# EAGLE design SplitterBoxRevC (EAGLE 7.5.0)
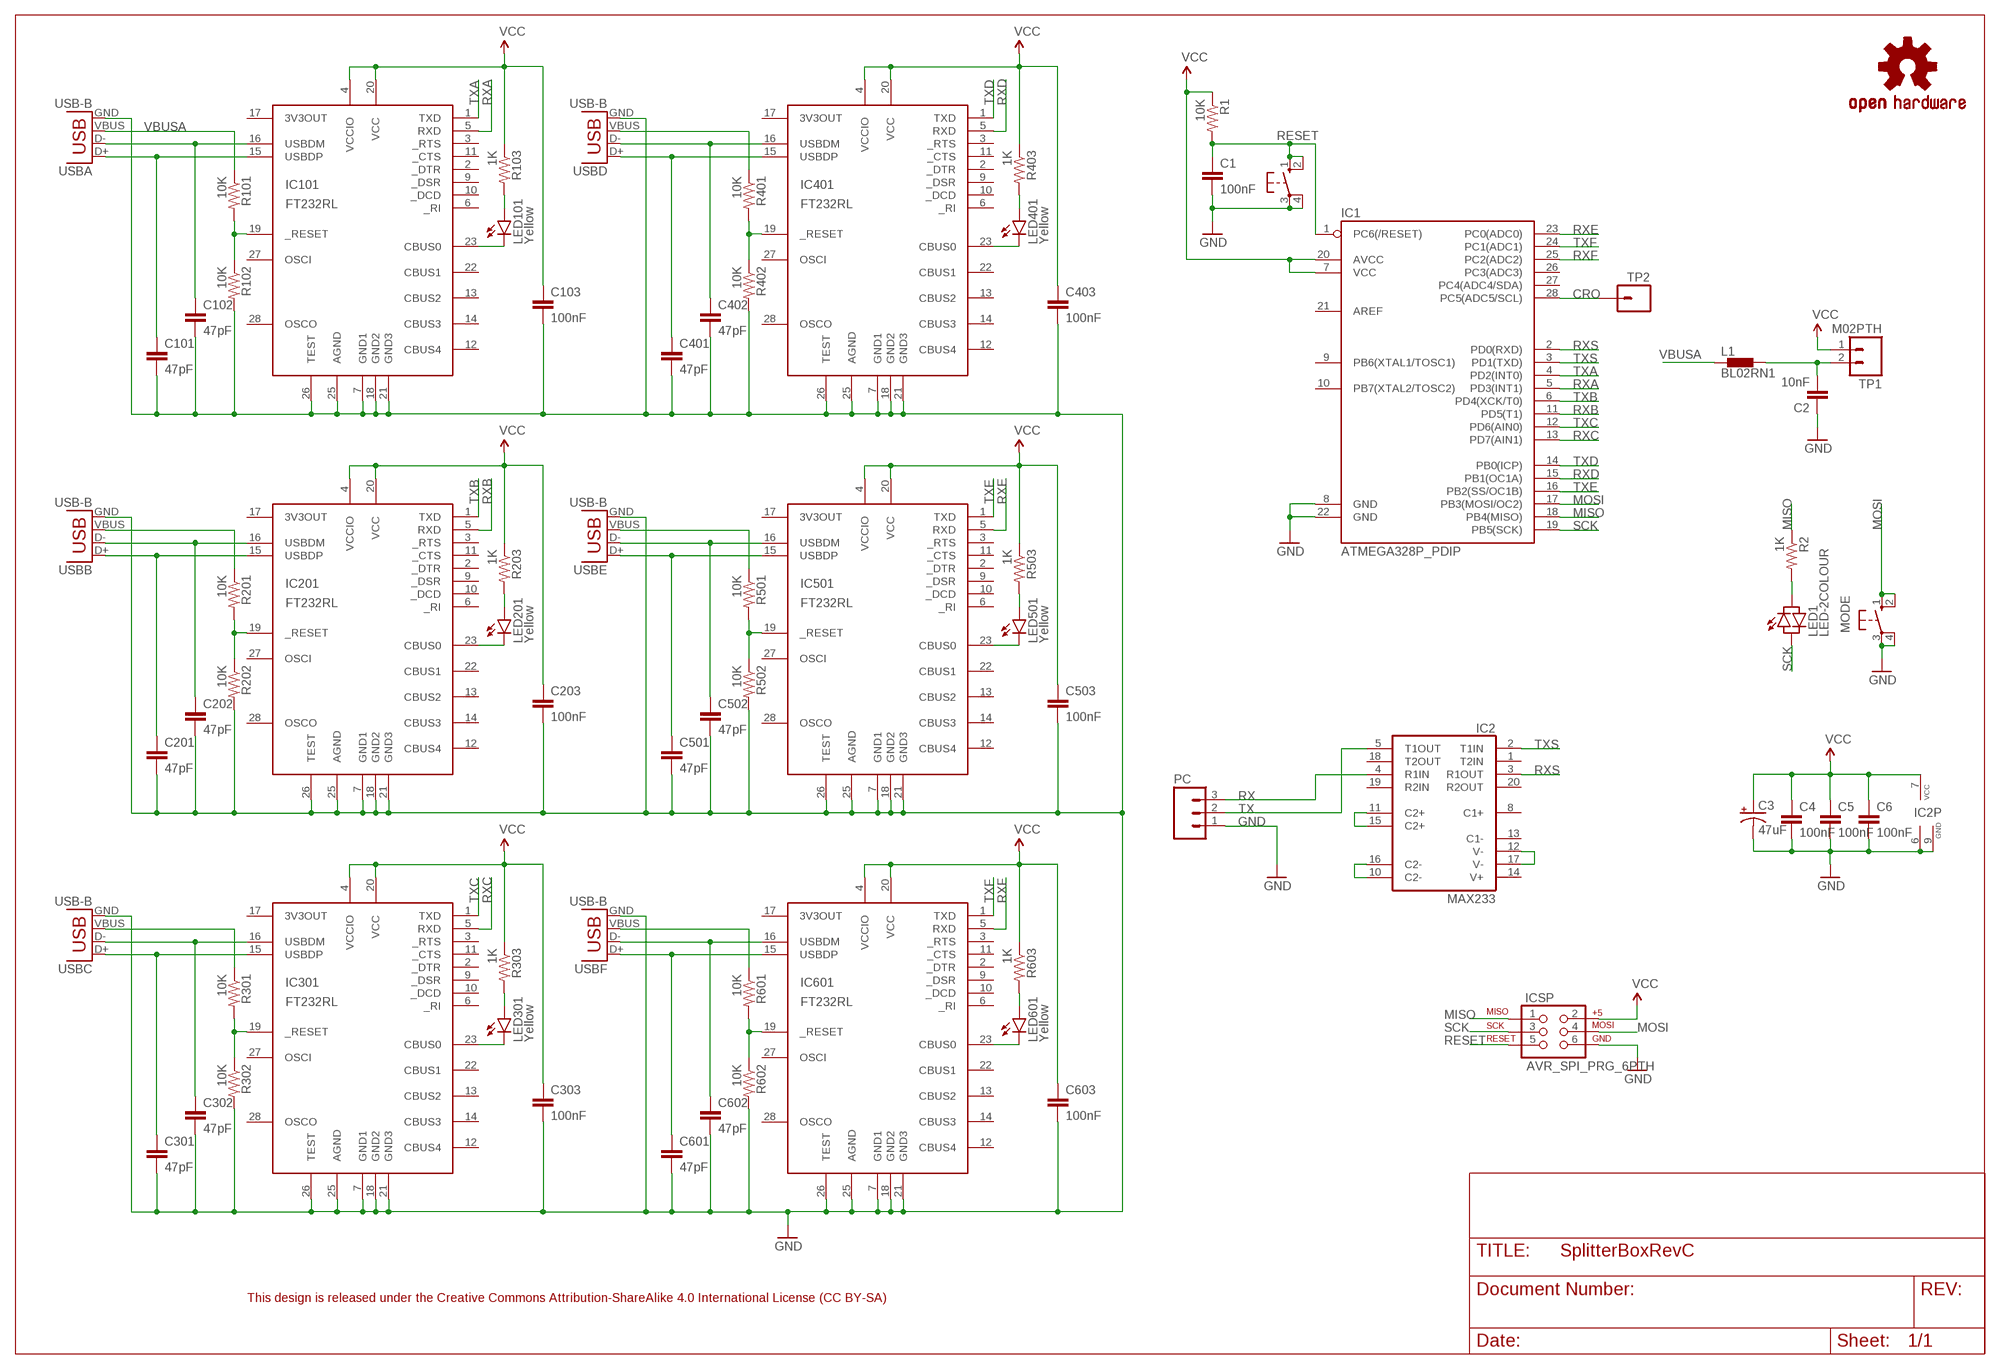
[diagram p0: schematic, sheet 1]

## Parts
C1  100nF  CAPPTH  [CAP-PTH-SMALL]
C2  10nF  CAPPTH  [CAP-PTH-SMALL]
C3  47uF  CAP_POLPTH1  [CPOL-RADIAL-100UF-25V]
C4  100nF  CAPPTH  [CAP-PTH-SMALL]
C5  100nF  CAPPTH  [CAP-PTH-SMALL]
C6  100nF  CAPPTH  [CAP-PTH-SMALL]
C101  47pF  CAPPTH  [CAP-PTH-SMALL]
C102  47pF  CAPPTH  [CAP-PTH-SMALL]
C103  100nF  CAPPTH  [CAP-PTH-SMALL]
C201  47pF  CAPPTH  [CAP-PTH-SMALL]
C202  47pF  CAPPTH  [CAP-PTH-SMALL]
C203  100nF  CAPPTH  [CAP-PTH-SMALL]
C301  47pF  CAPPTH  [CAP-PTH-SMALL]
C302  47pF  CAPPTH  [CAP-PTH-SMALL]
C303  100nF  CAPPTH  [CAP-PTH-SMALL]
C401  47pF  CAPPTH  [CAP-PTH-SMALL]
C402  47pF  CAPPTH  [CAP-PTH-SMALL]
C403  100nF  CAPPTH  [CAP-PTH-SMALL]
C501  47pF  CAPPTH  [CAP-PTH-SMALL]
C502  47pF  CAPPTH  [CAP-PTH-SMALL]
C503  100nF  CAPPTH  [CAP-PTH-SMALL]
C601  47pF  CAPPTH  [CAP-PTH-SMALL]
C602  47pF  CAPPTH  [CAP-PTH-SMALL]
C603  100nF  CAPPTH  [CAP-PTH-SMALL]
IC1  ATMEGA328P_PDIP  [DIL28-3]
IC2  MAX233  [DIL20]
IC101  FT232RL  [SSOP28DB]
IC201  FT232RL  [SSOP28DB]
IC301  FT232RL  [SSOP28DB]
IC401  FT232RL  [SSOP28DB]
IC501  FT232RL  [SSOP28DB]
IC601  FT232RL  [SSOP28DB]
ICSP  AVR_SPI_PRG_6PTH  [2X3]
L1  BL02RN1  [BL02RN1]
LED1  LED-2COLOUR  [LED3MM]
LED101  Yellow  LED-LH3MM  [LED3MM_LARGEHOLES]
LED201  Yellow  LED-LH3MM  [LED3MM_LARGEHOLES]
LED301  Yellow  LED-LH3MM  [LED3MM_LARGEHOLES]
LED401  Yellow  LED-LH3MM  [LED3MM_LARGEHOLES]
LED501  Yellow  LED-LH3MM  [LED3MM_LARGEHOLES]
LED601  Yellow  LED-LH3MM  [LED3MM_LARGEHOLES]
LOGO1  OSHW-LOGOS  [OSHW-LOGO-S]
MODE  10-XX  [B3F-10XX]
PC  M03PTH  [1X03]
R1  10K  RESISTORPTH-1/4W  [AXIAL-0.4]
R2  1K  RESISTORPTH-1/4W  [AXIAL-0.4]
R101  10K  RESISTORPTH-1/4W  [AXIAL-0.4]
R102  10K  RESISTORPTH-1/4W  [AXIAL-0.4]
R103  1K  RESISTORPTH-1/4W  [AXIAL-0.4]
R201  10K  RESISTORPTH-1/4W  [AXIAL-0.4]
R202  10K  RESISTORPTH-1/4W  [AXIAL-0.4]
R203  1K  RESISTORPTH-1/4W  [AXIAL-0.4]
R301  10K  RESISTORPTH-1/4W  [AXIAL-0.4]
R302  10K  RESISTORPTH-1/4W  [AXIAL-0.4]
R303  1K  RESISTORPTH-1/4W  [AXIAL-0.4]
R401  10K  RESISTORPTH-1/4W  [AXIAL-0.4]
R402  10K  RESISTORPTH-1/4W  [AXIAL-0.4]
R403  1K  RESISTORPTH-1/4W  [AXIAL-0.4]
R501  10K  RESISTORPTH-1/4W  [AXIAL-0.4]
R502  10K  RESISTORPTH-1/4W  [AXIAL-0.4]
R503  1K  RESISTORPTH-1/4W  [AXIAL-0.4]
R601  10K  RESISTORPTH-1/4W  [AXIAL-0.4]
R602  10K  RESISTORPTH-1/4W  [AXIAL-0.4]
R603  1K  RESISTORPTH-1/4W  [AXIAL-0.4]
RST  10-XX  [B3F-10XX]
TP1  M02PTH  [1X02]
TP2  M01PTH  [1X01]
USBA  USB-B  USBPTH  [USB-B-PTH]
USBB  USB-B  USBPTH  [USB-B-PTH]
USBC  USB-B  USBPTH  [USB-B-PTH]
USBD  USB-B  USBPTH  [USB-B-PTH]
USBE  USB-B  USBPTH  [USB-B-PTH]
USBF  USB-B  USBPTH  [USB-B-PTH]

## Nets
CRO: IC1.28(PC5(ADC5/SCL)) TP2.1
GND: C1.2 C2.1 C3.2(-) C4.2 C5.2 C6.2 C101.2 C102.2 C103.2 C201.2 C202.2 C203.2 C301.2 C302.2 C303.2 C401.2 C402.2 C403.2 C501.2 C502.2 C503.2 C601.2 C602.2 C603.2 IC1.8(GND) IC1.22(GND) IC2.6(GND) IC2.9(GND) IC101.7(GND1) IC101.18(GND2) IC101.21(GND3) IC101.25(AGND) IC101.26(TEST) IC201.7(GND1) IC201.18(GND2) IC201.21(GND3) IC201.25(AGND) IC201.26(TEST) IC301.7(GND1) IC301.18(GND2) IC301.21(GND3) IC301.25(AGND) IC301.26(TEST) IC401.7(GND1) IC401.18(GND2) IC401.21(GND3) IC401.25(AGND) IC401.26(TEST) IC501.7(GND1) IC501.18(GND2) IC501.21(GND3) IC501.25(AGND) IC501.26(TEST) IC601.7(GND1) IC601.18(GND2) IC601.21(GND3) IC601.25(AGND) IC601.26(TEST) ICSP.6 MODE.3(P) MODE.4(P1) PC.1 R102.P$2 R202.P$2 R302.P$2 R402.P$2 R502.P$2 R602.P$2 RST.3(P) RST.4(P1) USBA.GND USBB.GND USBC.GND USBD.GND USBE.GND USBF.GND
MISO: IC1.18(PB4(MISO)) ICSP.1 R2.P$1
MOSI: IC1.17(PB3(MOSI/OC2)) ICSP.4 MODE.1(S) MODE.2(S1)
N$1: C201.1 IC201.15(USBDP) USBB.D+
N$2: C202.1 IC201.16(USBDM) USBB.D-
N$3: IC201.19(_RESET) R201.P$2 R202.P$1
N$4: LED201.A R203.P$2
N$5: IC201.23(CBUS0) LED201.K(C)
N$6: C401.1 IC401.15(USBDP) USBD.D+
N$7: C402.1 IC401.16(USBDM) USBD.D-
N$9: IC2.10(C2-) IC2.16(C2-)
N$10: C2.2 L1.2 TP1.2
N$13: IC2.11(C2+) IC2.15(C2+)
N$14: IC2.12(V-) IC2.17(V-)
N$18: IC401.19(_RESET) R401.P$2 R402.P$1
N$19: LED401.A R403.P$2
N$20: IC401.23(CBUS0) LED401.K(C)
N$21: C301.1 IC301.15(USBDP) USBC.D+
N$22: C302.1 IC301.16(USBDM) USBC.D-
N$23: R201.P$1 USBB.VBUS
N$24: IC301.19(_RESET) R301.P$2 R302.P$1
N$25: LED301.A R303.P$2
N$27: IC301.23(CBUS0) LED301.K(C)
N$28: R301.P$1 USBC.VBUS
N$29: C101.1 IC101.15(USBDP) USBA.D+
N$30: C102.1 IC101.16(USBDM) USBA.D-
N$31: IC101.19(_RESET) R101.P$2 R102.P$1
N$32: LED101.A R103.P$2
N$33: IC101.23(CBUS0) LED101.K(C)
N$35: R401.P$1 USBD.VBUS
N$36: C501.1 IC501.15(USBDP) USBE.D+
N$37: C502.1 IC501.16(USBDM) USBE.D-
N$38: IC501.19(_RESET) R501.P$2 R502.P$1
N$39: LED501.A R503.P$2
N$40: IC501.23(CBUS0) LED501.K(C)
N$41: R501.P$1 USBE.VBUS
N$42: C601.1 IC601.15(USBDP) USBF.D+
N$43: C602.1 IC601.16(USBDM) USBF.D-
N$44: IC601.19(_RESET) R601.P$2 R602.P$1
N$45: LED601.A R603.P$2
N$46: IC601.23(CBUS0) LED601.K(C)
N$47: R601.P$1 USBF.VBUS
N$48: LED1.A R2.P$2
RESET: C1.1 IC1.1(PC6(/RESET)) ICSP.5 R1.P$2 RST.1(S) RST.2(S1)
RX: IC2.4(R1IN) PC.3
RXA: IC1.5(PD3(INT1)) IC101.5(RXD)
RXB: IC1.11(PD5(T1)) IC201.5(RXD)
RXC: IC1.13(PD7(AIN1)) IC301.5(RXD)
RXD: IC1.15(PB1(OC1A)) IC401.5(RXD)
RXE: IC1.23(PC0(ADC0)) IC501.5(RXD)
RXF: IC1.25(PC2(ADC2)) IC601.5(RXD)
RXS: IC1.2(PD0(RXD)) IC2.3(R1OUT)
SCK: IC1.19(PB5(SCK)) ICSP.3 LED1.K(C)
TX: IC2.5(T1OUT) PC.2
TXA: IC1.4(PD2(INT0)) IC101.1(TXD)
TXB: IC1.6(PD4(XCK/T0)) IC201.1(TXD)
TXC: IC1.12(PD6(AIN0)) IC301.1(TXD)
TXD: IC1.14(PB0(ICP)) IC401.1(TXD)
TXE: IC1.16(PB2(SS/OC1B)) IC501.1(TXD)
TXF: IC1.24(PC1(ADC1)) IC601.1(TXD)
TXS: IC1.3(PD1(TXD)) IC2.2(T1IN)
VBUSA: L1.1 R101.P$1 USBA.VBUS
VCC: C3.1(+) C4.1 C5.1 C6.1 C103.1 C203.1 C303.1 C403.1 C503.1 C603.1 IC1.7(VCC) IC1.20(AVCC) IC2.7(VCC) IC101.4(VCCIO) IC101.20(VCC) IC201.4(VCCIO) IC201.20(VCC) IC301.4(VCCIO) IC301.20(VCC) IC401.4(VCCIO) IC401.20(VCC) IC501.4(VCCIO) IC501.20(VCC) IC601.4(VCCIO) IC601.20(VCC) ICSP.2 R1.P$1 R103.P$1 R203.P$1 R303.P$1 R403.P$1 R503.P$1 R603.P$1 TP1.1
Unconnected: IC1.9(PB6(XTAL1/TOSC1)) IC1.10(PB7(XTAL2/TOSC2)) IC1.21(AREF) IC1.26(PC3(ADC3)) IC1.27(PC4(ADC4/SDA)) IC2.1(T2IN) IC2.8(C1+) IC2.13(C1-) IC2.14(V+) IC2.18(T2OUT) IC2.19(R2IN) IC2.20(R2OUT) IC101.2(_DTR) IC101.3(_RTS) IC101.6(_RI) IC101.9(_DSR) IC101.10(_DCD) IC101.11(_CTS) IC101.12(CBUS4) IC101.13(CBUS2) IC101.14(CBUS3) IC101.17(3V3OUT) IC101.22(CBUS1) IC101.27(OSCI) IC101.28(OSCO) IC201.2(_DTR) IC201.3(_RTS) IC201.6(_RI) IC201.9(_DSR) IC201.10(_DCD) IC201.11(_CTS) IC201.12(CBUS4) IC201.13(CBUS2) IC201.14(CBUS3) IC201.17(3V3OUT) IC201.22(CBUS1) IC201.27(OSCI) IC201.28(OSCO) IC301.2(_DTR) IC301.3(_RTS) IC301.6(_RI) IC301.9(_DSR) IC301.10(_DCD) IC301.11(_CTS) IC301.12(CBUS4) IC301.13(CBUS2) IC301.14(CBUS3) IC301.17(3V3OUT) IC301.22(CBUS1) IC301.27(OSCI) IC301.28(OSCO) IC401.2(_DTR) IC401.3(_RTS) IC401.6(_RI) IC401.9(_DSR) IC401.10(_DCD) IC401.11(_CTS) IC401.12(CBUS4) IC401.13(CBUS2) IC401.14(CBUS3) IC401.17(3V3OUT) IC401.22(CBUS1) IC401.27(OSCI) IC401.28(OSCO) IC501.2(_DTR) IC501.3(_RTS) IC501.6(_RI) IC501.9(_DSR) IC501.10(_DCD) IC501.11(_CTS) IC501.12(CBUS4) IC501.13(CBUS2) IC501.14(CBUS3) IC501.17(3V3OUT) IC501.22(CBUS1) IC501.27(OSCI) IC501.28(OSCO) IC601.2(_DTR) IC601.3(_RTS) IC601.6(_RI) IC601.9(_DSR) IC601.10(_DCD) IC601.11(_CTS) IC601.12(CBUS4) IC601.13(CBUS2) IC601.14(CBUS3) IC601.17(3V3OUT) IC601.22(CBUS1) IC601.27(OSCI) IC601.28(OSCO)

## Notes on the sheet
- This design is released under the Creative Commons Attribution-ShareAlike 4.0 International License (CC BY-SA)

## Library data of the parts
C1 C2 C4-C6 C101-C103 C201-C203 C301-C303 C401-C403 C501-C503 C601-C603 = SparkFun-Capacitors:CAP: Capacitor Standard 0603 ceramic capacitor, and 0.1" leaded capacitor.
C3 = SparkFun-Passives:CAP_POL: Capacitor Polarized These are standard SMD and PTH capacitors. Normally 10uF, 47uF, and 100uF in electrolytic and tantalum varieties. Always verify the external diameter of the through hole cap, it varies with capacity, voltage, and manufacturer. The EIA devices should be standard.
IC1 = SparkFun-DigitalIC:ATMEGA328P_PDIP: uC used in the Arduino 32kb flash, 1k EEPROM, 2k SRAM This is the through-hole version of this chip.
IC2 = maxim:MAX233: RS232 TRANSCEIVER; MPN: MAX233ACPP+G36; OC_FARNELL: 1593332; OC_NEWARK: 89K3459
IC101 IC201 IC301 IC401 IC501 IC601 = ftdichip-3:FT232RL: USB UART 4th Generation USB UART (USB <-> Serial) Controller
ICSP = SparkFun-Connectors:AVR_SPI_PRG_6: AVR ISP 6 Pin This is the reduced ISP connector for AVR programming. Common on Arduino. This footprint will take up less PCB space and can be used with a 10-pin to 6-pin adapter such as SKU: BOB-08508 **Special note about "TEST_POINT" package. The stop mask is on the top side, so if you want your programming test points to be on the bottom of your board, make sure to place this package on the bottom side of the board. This also ensure that the orientation to program from the bottom side will be correct.
L1 = inductors:BL0: Noise Suppression Products/EMI Suppression Filters, Lead EMIFIL(R) Inductor Type Source: http://www.murata.com .. BL01RN1_DS.pdf
LED1 = AIC_Custom:LED-2COLOUR
LED101 LED201 LED301 LED401 LED501 LED601 = AIC_Custom:LED-LH: LEDs Standard schematic elements and footprints for 5mm, 3mm, 1206, and 0603 sized LEDs. 5mm - Spark Fun Electronics SKU : COM-00529 (and others). Custom variant with larger (0.04") holes suitable for header pins as an alternative.
LOGO1 = SparkFun-Aesthetics:OSHW-LOGO: Open Source Hardware Logo This logo indicates the piece of hardware it is found on incorporates a OSHW license and/or adheres to the definition of open source hardware found here: http://freedomdefined.org/OSHW
MODE RST = switch-omron:10-XX: OMRON SWITCH; MPN: B3F-1000; OC_FARNELL: 176432; OC_NEWARK: 36M3542
PC = SparkFun-Connectors:M03: Header 3 Standard 3-pin 0.1" header. Use with straight break away headers (SKU : PRT-00116), right angle break away headers (PRT-00553), swiss pins (PRT-00743), machine pins (PRT-00117), and female headers (PRT-00115). Molex polarized connector foot print use with SKU : PRT-08232 with associated crimp pins and housings.
R1 R2 R101-R103 R201-R203 R301-R303 R401-R403 R501-R503 R601-R603 = SparkFun-Passives:RESISTOR: Resistor Basic schematic elements and footprints for 0603, 1206, and PTH resistors.
TP1 = SparkFun-Connectors:M02: Standard 2-pin 0.1" header. Use with - straight break away headers ( PRT-00116) - right angle break away headers (PRT-00553) - swiss pins (PRT-00743) - machine pins (PRT-00117) - female headers (PRT-00115) Molex polarized connector foot print use with: PRT-08233 with associated crimp pins and housings. 2.54_SCREWTERM for use with PRT-10571. 3.5mm Screw Terminal footprints for PRT-08084 5mm Screw Terminal footprints for use with PRT-08432
TP2 = SparkFun-Connectors:M01: Header 1 Standard 1-pin 0.1" header. Use with straight break away headers (SKU : PRT-00116), right angle break away headers (PRT-00553), swiss pins (PRT-00743), machine pins (PRT-00117), and female headers (PRT-00115).
USBA USBB USBC USBD USBE USBF = SparkFun-Connectors:USB: USB Connectors USB-B-PTH is fully proven SKU : PRT-00139/CONN-08278 USB-miniB is fully proven SKU : PRT-00587 USB-A-PCB is untested. USB-A-H is throughly reviewed, but untested. Spark Fun Electronics SKU : PRT-00437 USB-B-SMT is throughly reviewed, but untested. Needs silkscreen touching up. USB-A-S has not been used/tested USB-MB-H has not been used/tested USB-MICROB has been used. CONN-09505; PROD_ID: CONN-08278

## Board
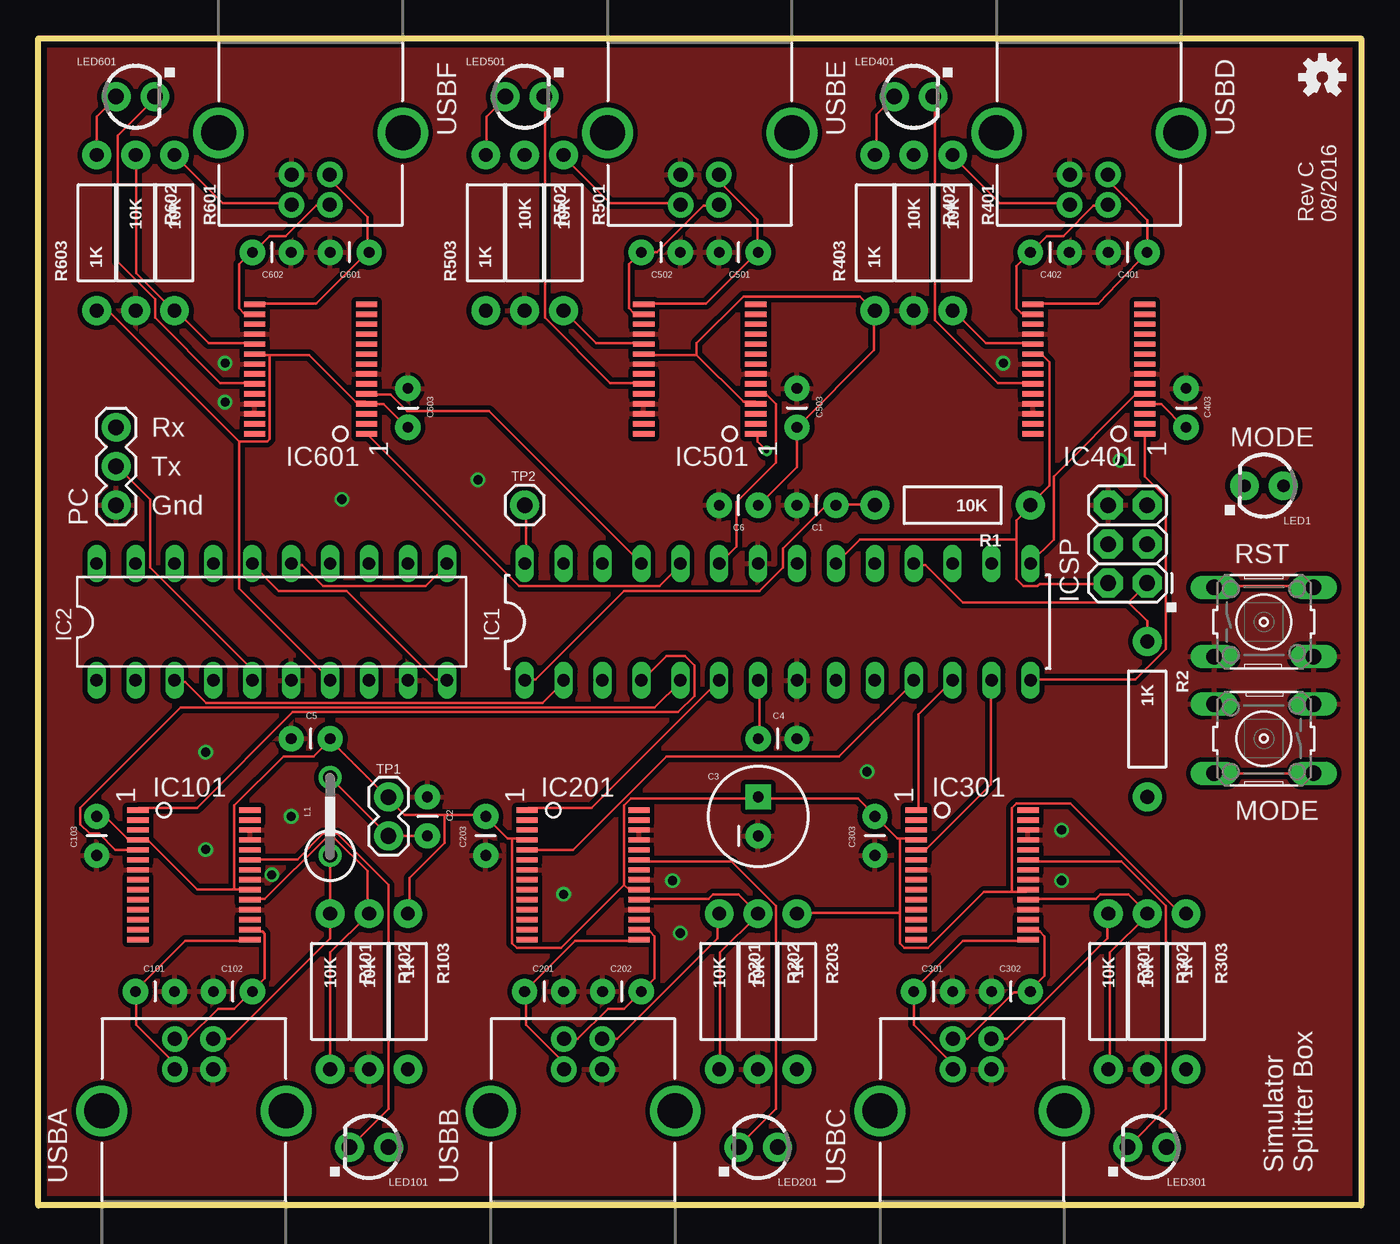
[diagram p1: board, top side]
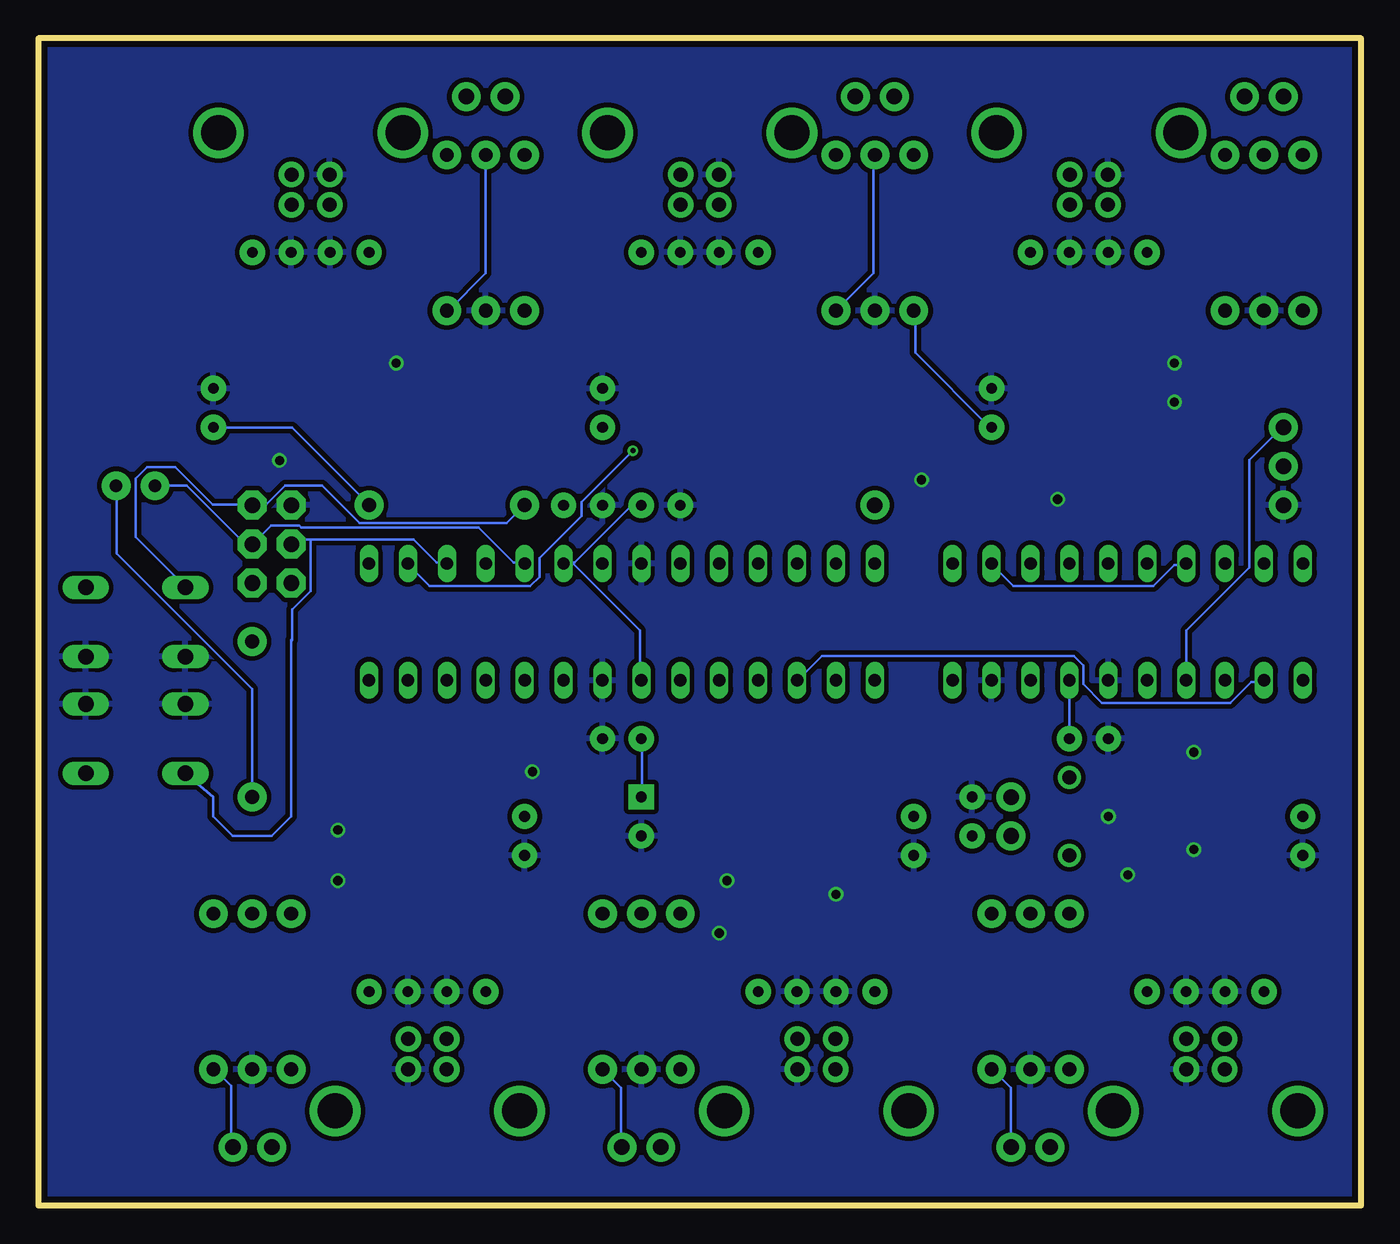
[diagram p2: board, bottom side, seen from below]

Size 86.36 x 76.2 mm. Coordinates in mm from the lower left corner, seen from the top.
Outline: 0,76.2 86.36,76.2 86.36,0 0,0 0,76.2
Copper layers (1*16): Top 0.0356mm / dielectric 1.5011mm / Bottom 0.0356mm
Design rules "LaenPCBOrder(OSHPARK)": minimum track width 6mil, minimum drill 13mil, track to track 6mil, track to pad 6mil, pad to pad 6mil, via to via 6mil, smd to smd 6mil, copper to edge 15mil, drill to drill 6mil, minimum pad ring 7mil, minimum via ring 7mil, stop-mask expansion 3mil, vias tented up to drill 0mil, thermal gap 10mil

### Footprints (pad centres in the part's own frame; a part is rotated, then mirrored left to right if it is on the bottom)
CAP-PTH-SMALL = drill 0.7 pad 1.651: 1 0,0; 2 2.54,0
CPOL-RADIAL-100UF-25V = drill 0.7 pad 1.651 square: 1 1.27,0 | drill 0.7 pad 1.651: 2 -1.27,0
DIL28-3 = drill 0.813 long: 1 -16.51,-3.81; 2 -13.97,-3.81; 3 -11.43,-3.81; 4 -8.89,-3.81; 5 -6.35,-3.81; 6 -3.81,-3.81; 7 -1.27,-3.81; 8 1.27,-3.81; 9 3.81,-3.81; 10 6.35,-3.81; 11 8.89,-3.81; 12 11.43,-3.81; 13 13.97,-3.81; 14 16.51,-3.81; 15 16.51,3.81; 16 13.97,3.81; 17 11.43,3.81; 18 8.89,3.81; 19 6.35,3.81; 20 3.81,3.81; 21 1.27,3.81; 22 -1.27,3.81; 23 -3.81,3.81; 24 -6.35,3.81; 25 -8.89,3.81; 26 -11.43,3.81; 27 -13.97,3.81; 28 -16.51,3.81
DIL20 = drill 0.813 long: 1 -11.43,-3.81; 2 -8.89,-3.81; 3 -6.35,-3.81; 4 -3.81,-3.81; 5 -1.27,-3.81; 6 1.27,-3.81; 7 3.81,-3.81; 8 6.35,-3.81; 9 8.89,-3.81; 10 11.43,-3.81; 11 11.43,3.81; 12 8.89,3.81; 13 6.35,3.81; 14 3.81,3.81; 15 1.27,3.81; 16 -1.27,3.81; 17 -3.81,3.81; 18 -6.35,3.81; 19 -8.89,3.81; 20 -11.43,3.81
SSOP28DB = smd 0.348 x 1.397: 1 -4.225,-3.656; 2 -3.575,-3.656; 3 -2.925,-3.656; 4 -2.275,-3.656; 5 -1.625,-3.656; 6 -0.975,-3.656; 7 -0.325,-3.656; 8 0.325,-3.656; 9 0.975,-3.656; 10 1.625,-3.656; 11 2.275,-3.656; 12 2.925,-3.656; 13 3.575,-3.656; 14 4.225,-3.656; 15 4.225,3.656; 16 3.575,3.656; 17 2.925,3.656; 18 2.275,3.656; 19 1.625,3.656; 20 0.975,3.656; 21 0.325,3.656; 22 -0.325,3.656; 23 -0.975,3.656; 24 -1.625,3.656; 25 -2.275,3.656; 26 -2.925,3.656; 27 -3.575,3.656; 28 -4.225,3.656
2X3 = drill 1.016 pad 1.88 octagon: 1 0,0; 2 0,2.54; 3 2.54,0; 4 2.54,2.54; 5 5.08,0; 6 5.08,2.54
BL02RN1 = drill 0.9 pad 1.5: 1 -2.54,0; 2 2.54,0
LED3MM = drill 0.813 pad 1.88: A -1.27,0; K 1.27,0
LED3MM_LARGEHOLES = drill 1.016 pad 1.88: A -1.27,0; K 1.27,0
B3F-10XX = drill 1.016 long: 1 -3.251,2.261; 2 3.251,2.261; 3 -3.251,-2.261; 4 3.251,-2.261
1X03 = drill 1.016 pad 1.88: 1 0,0; 2 2.54,0; 3 5.08,0
AXIAL-0.4 = drill 0.9 pad 1.88: P$1 -5.08,0; P$2 5.08,0
1X02 = drill 1.016 pad 1.88: 1 0,0; 2 2.54,0
1X01 = drill 1.016 pad 1.88: 1 0,0
USB-B-PTH = drill 0.914 pad 1.676: D+ 0,1.25; D- 1.981,1.25; GND 0,-1.25; VBUS 1.981,-1.25 | drill 2.286: S1 -2.718,-6.02; S2 -2.718,6.02

### Placement (x,y rotation side)
C1  52.07,45.72 180 top
C2  25.4,26.67 270 top
C3  46.99,25.4 90 top
C4  46.99,30.48 0 top
C5  19.05,30.48 180 top
C6  46.99,45.72 180 top
C101  6.35,13.97 0 top
C102  13.97,13.97 180 top
C103  3.81,25.4 270 top
C201  31.75,13.97 0 top
C202  39.37,13.97 180 top
C203  29.21,25.4 270 top
C301  57.15,13.97 0 top
C302  64.77,13.97 180 top
C303  54.61,25.4 270 top
C401  72.39,62.23 180 top
C402  64.77,62.23 0 top
C403  74.93,50.8 90 top
C501  46.99,62.23 180 top
C502  39.37,62.23 0 top
C503  49.53,50.8 90 top
C601  21.59,62.23 180 top
C602  13.97,62.23 0 top
C603  24.13,50.8 90 top
IC1  48.26,38.1 0 top
IC2  15.24,38.1 0 top
IC101  10.16,21.59 270 top
IC201  35.56,21.59 270 top
IC301  60.96,21.59 270 top
IC401  68.58,54.61 90 top
IC501  43.18,54.61 90 top
IC601  17.78,54.61 90 top
ICSP  72.39,40.64 90 top
L1  19.05,25.4 90 top
LED1  80.01,46.99 180 top
LED101  21.59,3.81 180 top
LED201  46.99,3.81 180 top
LED301  72.39,3.81 180 top
LED401  57.15,72.39 0 top
LED501  31.75,72.39 0 top
LED601  6.35,72.39 0 top
LOGO1  83.82,73.66 0 top
MODE  80.01,30.48 180 top
PC  5.08,45.72 90 top
R1  59.69,45.72 180 top
R2  72.39,31.75 270 top
R101  19.05,13.97 270 top
R102  21.59,13.97 270 top
R103  24.13,13.97 270 top
R201  44.45,13.97 270 top
R202  46.99,13.97 270 top
R203  49.53,13.97 270 top
R301  69.85,13.97 270 top
R302  72.39,13.97 270 top
R303  74.93,13.97 270 top
R401  59.69,63.5 270 top
R402  57.15,63.5 270 top
R403  54.61,63.5 90 top
R501  34.29,63.5 270 top
R502  31.75,63.5 270 top
R503  29.21,63.5 90 top
R601  8.89,63.5 270 top
R602  6.35,63.5 270 top
R603  3.81,63.5 90 top
RST  80.01,38.1 0 top
TP1  22.86,26.67 270 top
TP2  31.75,45.72 0 top
USBA  10.16,8.89 90 top
USBB  35.56,8.89 90 top
USBC  60.96,8.89 90 top
USBD  68.58,67.31 270 top
USBE  43.18,67.31 270 top
USBF  17.78,67.31 270 top

### Tracks (layer width: path | path; a pad name or v marks a point on that pad's centre or on a via)
CRO
  Top 0.152: IC1.28 31.85,41.96 31.85,45.62 TP2.1
GND  (via drill 0.6)
  other vias: 12.19,54.99 12.19,52.45 62.99,54.99 70.61,48.64 66.8,24.51 66.8,21.21 41.4,21.21 41.91,17.78 34.29,20.32 16.51,25.4 15.24,21.59 19.81,46.1 28.7,47.37 10.92,29.59 10.92,23.24 54.1,28.32
  pour Bottom (isolate 0.305): 0,76.2 0,0 86.36,0 86.36,76.2
  pour Top (isolate 0.305): 0,76.2 0,0 86.36,0 86.36,76.2
MISO
  Top 0.152: 71.17,39.37 60.35,39.37 57.91,41.81 57.15,41.81 IC1.18 | 71.17,39.37 72.39,40.59 ICSP.1 | R2.P$1 72.39,38.15 71.17,39.37
MOSI
  Top 0.152: MODE.1 MODE.2
  Bottom 0.152: 68.58,43.48 69.49,43.48 69.8,43.18 ICSP.4 | 68.58,43.48 61.87,43.48 60.35,41.96 59.74,41.96 IC1.17 | 68.58,43.48 68.58,40.13 69.8,38.91 69.8,36.93 69.85,36.93 69.85,25.4 71.12,24.13 73.66,24.13 74.93,25.4 74.93,26.67 MODE.2
N$1
  Top 0.152: IC201.15 39.17,17.27 35.05,17.27 C201.1 31.85,13.92 31.85,11.79 34.29,9.35 34.29,8.89 USBB.D+
N$2
  Top 0.152: IC201.16 39.32,17.88 39.93,17.88 40.23,17.58 40.23,14.83 C202.1 38.25,12.85 37.19,12.85 35.2,10.87 USBB.D-
N$3
  Top 0.152: IC201.19 39.32,20.02 43.74,20.02 44.04,20.32 45.72,20.32 R202.P$1 46.94,18.95 44.5,16.51 44.5,8.89 R201.P$2
N$4
  Bottom 0.152: R203.P$2 48.31,7.67 48.31,3.86 LED201.A
N$5
  Top 0.152: IC201.23 39.32,22.45 45.26,22.45 48.16,19.56 48.16,6.3 45.72,3.86 LED201.K
N$6
  Top 0.152: IC401.15 65.08,58.88 66.45,58.88 69.22,58.86 C401.1 72.39,64.32 71.02,65.73 69.95,66.8 69.95,67.26 USBD.D+
N$7
  Top 0.152: IC401.16 64.92,58.27 64.16,58.27 63.86,58.57 63.86,61.32 C402.1 65.84,63.3 66.9,63.3 68.89,65.28 69.8,65.28 USBD.D-
N$9
  Top 0.152: IC2.10 26.67,34.34 25.91,34.34 20.12,40.13 15.7,40.13 14.02,41.81 IC2.16
N$10
  Top 0.152: L1.2 TP1.2 C2.2
N$13
  Top 0.152: IC2.15 16.61,41.81 17.22,41.81 18.59,40.44 25.3,40.44 26.67,41.81 IC2.11
N$14
  Bottom 0.152: IC2.17 11.43,41.81 12.19,41.81 13.56,40.44 22.71,40.44 24.08,41.81 IC2.12
N$18
  Top 0.152: IC401.19 64.92,56.29 61.87,56.29 59.74,58.42 R401.P$2
  Bottom 0.152: R402.P$1 57.15,60.86 59.59,58.42 R401.P$2
N$19
  Top 0.152: LED401.A 54.71,71.22 54.71,68.63 R403.P$2
N$20
  Top 0.152: IC401.23 64.92,53.7 62.64,53.7 58.52,57.81 58.52,72.29 LED401.K
N$21
  Top 0.152: IC301.15 64.47,17.27 60.35,17.27 57.15,14.07 C301.1 57.15,11.79 59.59,9.35 59.59,8.89 USBC.D+
N$22
  Top 0.152: IC301.16 64.62,17.88 65.38,17.88 65.68,17.58 65.68,14.99 64.77,14.07 C302.1 64.77,13.92 63.7,13.92 60.66,10.87 USBC.D-
N$23
  Top 0.152: USBB.VBUS 37.8,10.87 44.35,17.42 44.35,18.95 R201.P$1
N$24
  Top 0.152: IC301.19 64.62,20.02 69.04,20.02 69.34,20.32 71.17,20.32 72.39,19.1 R302.P$1 72.39,18.95 69.95,16.51 69.95,8.89 R301.P$2
N$25
  Bottom 0.152: LED301.A 73.76,3.86 73.76,7.82 74.83,8.89 R303.P$2
N$27
  Top 0.152: LED301.K 73.61,6.3 73.61,19.56 70.71,22.45 64.62,22.45 IC301.23
N$28
  Top 0.152: USBC.VBUS 63.25,10.87 69.8,17.42 69.8,18.95 R301.P$1
N$29
  Top 0.152: IC101.15 13.72,17.27 9.6,17.27 6.4,14.07 C101.1 6.4,13.92 6.4,11.79 8.84,9.35 8.84,8.89 USBA.D+
N$30
  Top 0.152: IC101.16 13.87,17.88 14.63,17.88 14.78,17.73 14.78,14.83 14.02,14.07 C102.1 13.87,13.92 12.8,12.85 11.73,12.85 9.75,10.87 USBA.D-
N$31
  Top 0.152: IC101.19 13.87,20.02 14.78,20.02 18.75,23.98 19.36,23.98 21.49,21.84 21.49,19.1 R102.P$1 19.05,16.51 R101.P$2
N$32
  Bottom 0.152: LED101.A 22.86,7.67 24.08,8.89 R103.P$2
N$33
  Top 0.152: IC101.23 13.87,22.61 16.92,22.61 18.59,24.28 19.51,24.28 22.86,20.93 22.86,6.3 20.42,3.86 LED101.K
N$35
  Top 0.152: USBD.VBUS 67.21,65.43 62.79,65.43 59.74,68.48 R401.P$1
N$36
  Top 0.152: 46.94,62.23 43.59,58.88 39.62,58.88 IC501.15 | 46.94,62.23 46.94,64.36 44.5,66.8 44.5,67.26 USBE.D+ | 46.94,62.23 C501.1
N$37
  Top 0.152: IC501.16 39.47,58.27 38.86,58.27 38.56,58.57 38.56,61.47 39.32,62.23 C502.1 40.39,62.23 43.43,65.28 44.35,65.28 USBE.D-
N$38
  Top 0.152: R501.P$2 36.42,56.29 39.47,56.29 IC501.19
  Bottom 0.152: R501.P$2 31.85,60.86 31.85,68.48 R502.P$1
N$39
  Top 0.152: R503.P$2 29.26,68.63 29.26,71.07 30.48,72.29 LED501.A
N$40
  Top 0.152: IC501.23 39.47,53.7 37.34,53.7 33.07,57.96 33.07,72.29 LED501.K
N$41
  Top 0.152: USBE.VBUS 41.91,65.43 37.34,65.43 34.29,68.48 R501.P$1
N$42
  Top 0.152: 21.49,62.23 18.14,58.88 14.17,58.88 IC601.15 | 21.49,62.23 21.49,64.52 19.05,66.95 19.05,67.26 USBF.D+ | 21.49,62.23 C601.1
N$43
  Top 0.152: IC601.16 14.02,58.27 13.41,58.27 13.11,58.57 13.11,61.47 13.87,62.23 C602.1 14.02,62.23 15.09,63.3 16.15,63.3 18.14,65.28 18.9,65.28 USBF.D-
N$44
  Top 0.152: IC601.19 14.02,56.29 11.12,56.29 8.99,58.42 R601.P$2 8.84,58.42 6.4,60.86 6.4,68.48 R602.P$1
N$45
  Top 0.152: R603.P$2 3.81,71.07 5.03,72.29 LED601.A
N$46
  Top 0.152: IC601.23 14.02,53.7 11.89,53.7 7.62,57.96 7.62,59.18 5.18,61.62 5.18,69.85 7.62,72.29 LED601.K
N$47
  Top 0.152: R601.P$1 12.04,65.43 16.46,65.43 USBF.VBUS
N$48
  Bottom 0.152: R2.P$2 72.39,33.73 81.23,42.57 81.23,46.99 LED1.A
RESET
  Top 0.152: RST.1 76.81,40.44 83.21,40.44 RST.2 | IC1.1 31.85,34.34 32.46,34.34 38.25,40.13 47.09,40.13 48.62,41.66 48.62,42.88 51.36,45.62 51.97,45.62 C1.1 52.12,45.77 54.56,45.77 R1.P$2
  Bottom 0.152: 72.39,45.77 74.98,45.77 77.42,48.21 79.25,48.21 80.01,47.45 80.01,43.64 76.81,40.44 RST.1 | 72.39,45.77 71.48,45.77 70.26,46.99 67.82,46.99 65.38,44.55 55.78,44.55 R1.P$2 | 72.39,45.77 ICSP.5
RX
  Bottom 0.152: IC2.4 11.43,37.54 7.32,41.66 7.32,48.67 5.18,50.8 PC.3
RXA
  Top 0.152: IC101.5 6.4,23.22 5.03,23.22 3.96,24.28 3.35,24.28 2.74,24.89 2.74,25.96 9.3,32.51 40.23,32.51 41.91,34.19 IC1.5
RXB
  Top 0.152: IC201.5 32,23.22 34.9,23.22 41,29.31 52.27,29.31 57.15,34.19 IC1.11
RXC
  Top 0.152: IC301.5 57.45,23.22 57.91,23.22 62.18,27.48 62.18,34.19 IC1.13
RXD
  Top 0.152: IC401.5 72.08,52.93 71.63,52.93 66.29,47.6 66.29,43.48 64.77,41.96 IC1.15
RXE
  Top 0.152: IC1.23 45.57,43.03 45.57,45.92 48.16,48.51 48.16,52.32 47.55,52.93 46.94,52.93 IC501.5
RXF
  Top 0.152: IC1.25 29.41,51.87 24.08,51.87 23.01,52.93 21.49,52.93 IC601.5
RXS
  Top 0.152: IC2.3 8.99,34.19 9.6,34.19 10.97,32.82 32.92,32.82 34.29,34.19 IC1.2
SCK
  Bottom 0.152: IC1.19 54.71,41.96 55.32,41.96 57.61,44.25 69.19,44.25 69.34,44.4 71.17,44.4 ICSP.3 72.85,43.18 76.66,46.99 LED1.K
TX
  Top 0.152: IC2.5 13.87,34.34 13.87,35.1 7.32,41.66 7.32,46.08 5.18,48.21 PC.2
TXA
  Top 0.152: IC101.1 6.55,25.96 10.36,25.96 16.61,32.21 41.76,32.21 42.82,33.27 42.82,35.26 42.22,35.87 41,35.87 39.47,34.34 IC1.4
TXB
  Top 0.152: IC1.6 36.12,25.96 32,25.96 IC201.1
TXC
  Top 0.152: IC1.12 57.45,32.05 57.45,25.96 IC301.1
TXD
  Top 0.152: IC401.1 72.24,50.34 72.24,47.6 73.61,46.23 73.61,36.32 71.63,34.34 64.77,34.34 IC1.14
TXE  (via drill 0.33)
  Top 0.152: v47.55,49.28 46.94,49.89 46.94,50.34 IC501.1
  Bottom 0.152: v47.55,49.28 50.9,45.92 50.9,45.01 53.65,42.27 53.65,41.05 54.25,40.44 60.81,40.44 62.18,41.81 IC1.16
TXF
  Top 0.152: IC601.1 21.49,50.34 31.39,40.44 40.54,40.44 41.91,41.81 IC1.24
TXS
  Bottom 0.152: IC2.2 6.4,34.19 7.16,34.19 8.53,32.82 16.92,32.82 18.14,34.04 18.14,35.26 18.75,35.87 35.2,35.87 36.73,34.34 IC1.3
VBUSA
  Top 0.152: L1.1 R101.P$1 19.05,17.42 12.5,10.87 USBA.VBUS
VCC
  Top 0.152: C603.1 24.08,50.8 22.55,52.32 21.49,52.32 IC601.4 21.34,52.48 20.73,52.48 17.68,55.52 15.09,55.52 | 15.09,55.52 14.17,55.52 IC601.20 | R603.P$1 4.57,58.42 13.11,49.89 | 13.11,49.89 14.94,49.89 15.09,50.04 15.09,55.52 | 12.8,20.62 10.36,20.62 7.16,23.82 6.55,23.82 IC101.4 6.4,23.98 5.79,23.98 4.42,25.35 3.81,25.35 C103.1 | 12.8,20.62 13.72,20.62 IC101.20 | 30.94,23.98 30.63,23.98 C203.1 29.11,25.5 26.52,25.5 | 30.94,23.98 31.85,23.98 IC201.4 | 26.52,25.5 23.93,25.5 22.86,26.57 | 26.52,25.5 26.52,23.67 24.23,21.39 24.23,19.1 R103.P$1 | 22.86,26.57 19.05,30.38 | 22.86,26.57 TP1.1 | 12.8,20.62 12.8,26.11 16,29.31 17.98,29.31 19.05,30.38 | 19.05,30.38 C5.1 | 13.11,49.89 13.11,40.28 19.05,34.34 IC2.7 | IC1.7 47.09,34.19 47.09,30.53 C4.1 | 38.25,20.93 38.56,20.62 39.17,20.62 IC201.20 | 38.25,20.93 38.25,26.11 38.71,26.57 46.94,26.57 C3.1 47.09,26.57 53.49,26.57 54.56,25.5 C303.1 54.71,25.35 56.08,23.98 56.24,23.98 | 56.24,23.98 57.3,23.98 IC301.4 | 63.55,20.47 61.72,20.47 58.06,16.82 56.54,16.82 56.24,17.12 56.24,19.1 | 63.55,20.47 64.47,20.47 IC301.20 | 56.24,23.98 56.24,19.1 | 56.24,19.1 49.53,19.1 R203.P$1 | 63.55,20.47 63.55,25.96 63.86,26.26 67.36,26.26 74.52,19.1 74.83,19.1 R303.P$1 | IC401.4 72.24,52.32 73.3,52.32 74.83,50.8 C403.1 | IC401.20 65.08,55.52 65.53,55.52 65.99,55.07 65.99,46.99 64.77,45.77 R1.P$1 64.77,45.62 63.86,44.7 63.86,43.48 | 63.86,43.48 63.86,40.89 64.31,40.44 65.23,40.44 65.38,40.59 69.8,40.59 ICSP.2 | 42.98,55.52 39.62,55.52 IC501.20 | 42.98,55.52 46.02,52.48 46.79,52.48 IC501.4 | C6.1 47.09,45.77 49.53,48.21 C503.1 54.56,55.83 54.56,58.42 | 42.98,55.52 42.98,56.29 46.02,59.33 53.65,59.33 54.56,58.42
  Top 0.152: 54.56,58.42 R403.P$1 | 63.86,43.48 53.65,43.48 IC1.20 | 30.94,23.98 30.94,17.12 31.24,16.82 34.14,16.82 38.25,20.93
  Bottom 0.152: R503.P$1 29.11,58.42 29.11,55.68 24.23,50.8 C603.1 | C5.1 IC2.7 | C4.1 46.94,30.38 46.94,26.72 C3.1 | C403.1 69.8,50.8 64.77,45.77 R1.P$1 | 51.51,41.96 51.36,41.96 47.7,45.62 47.09,45.62 C6.1 | 51.51,41.96 51.97,41.96 IC1.20 51.51,41.96 | 51.51,41.96 47.09,37.54 47.09,34.34 IC1.7

### Text on the board
tPlace: Rev C / 08/2016 | MODE | Rx / Tx / Gnd | Simulator / Splitter Box